# Altium project ascenseur.PrjPCB
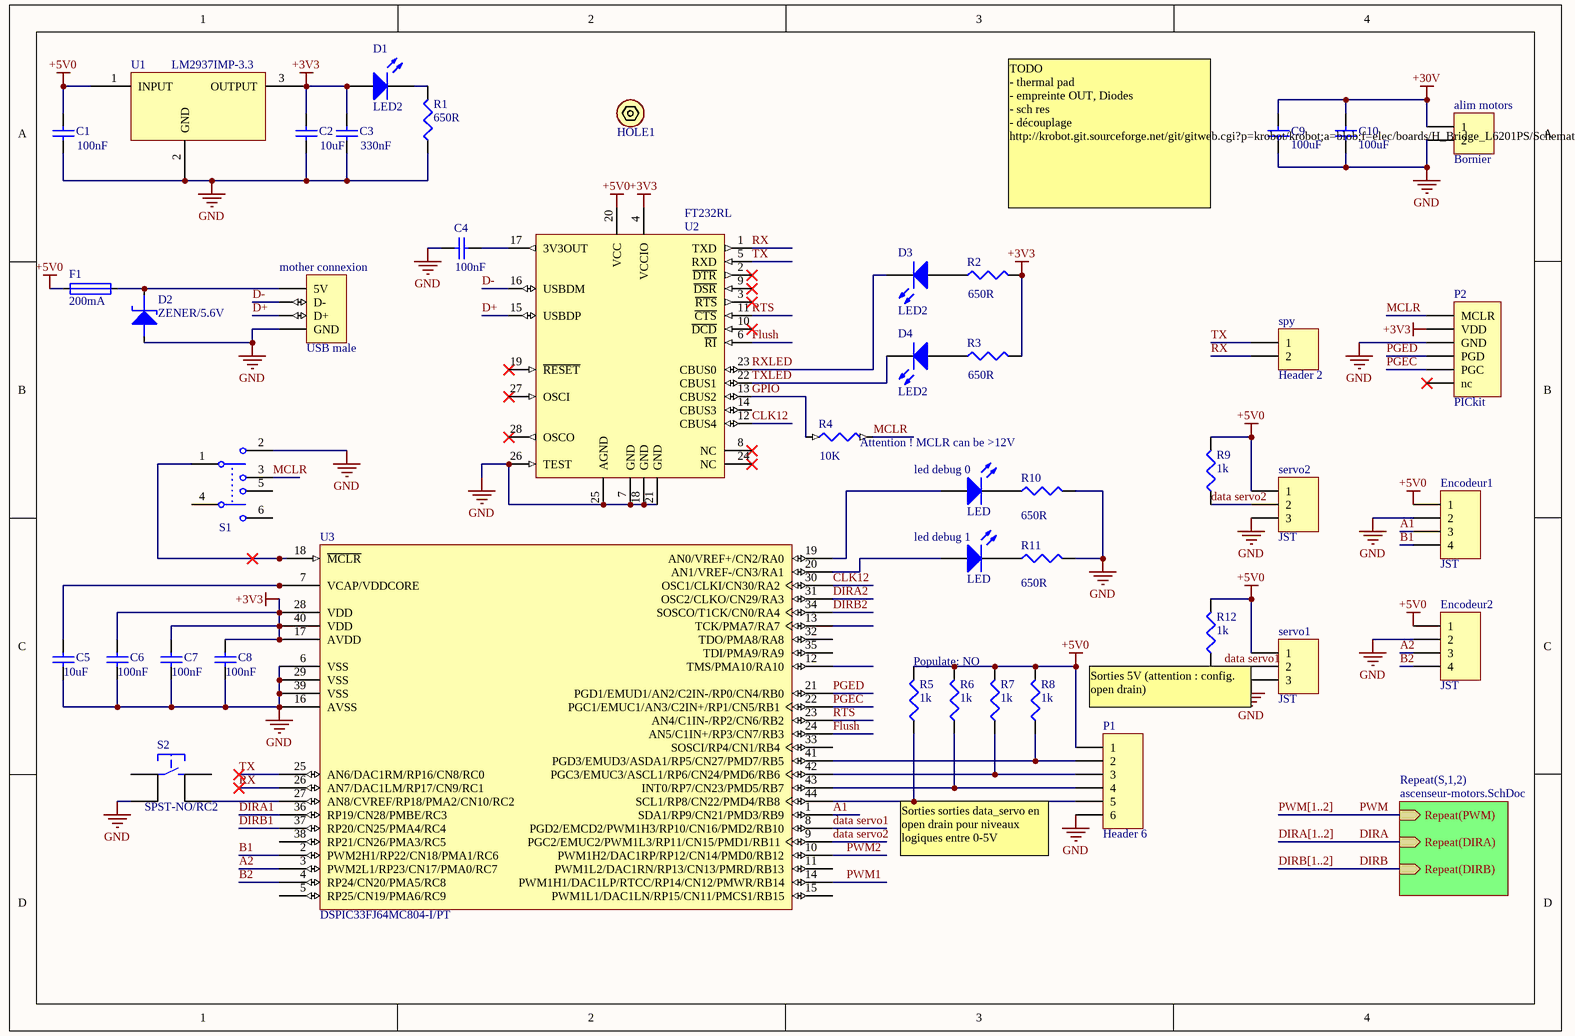
[diagram p0: ascenseur-asserv.SchDoc]
2 sheets, 70 parts. Net scope: hierarchical (ports join the sheet entries above them; power ports are global).
Board file: ascenseur.PcbDoc
Sheets:
  ascenseur-asserv.SchDoc
    S1 = ascenseur-motors.SchDoc
    S2 = ascenseur-motors.SchDoc

## Sheet ascenseur-asserv.SchDoc
size A4

### Parts
(Parts that share a designator on the sheet are numbered #1, #2 ... from top to bottom, then left to right.)
alim_motors  Bornier  [Bornier male coude 2 voies]
C1#1  value 100nF  [C0805C]
C2#1  value 10uF  [C0805C]
C3#1  value 330nF  [C0805C]
C4#1  value 100nF  [C0805C]
C5#1  value 10uF  [C0805C]
C6  value 100nF  [C0805C]
C7  value 100nF  [C0805C]
C8  value 100nF  [C0805C]
C9  value 100uF  [Capacitor axial leaded]  (hidden comment: CAP)
C10  value 100uF  [C0805C]  (hidden comment: CAP)
D1#1  LED2  [LED1206G]
D2  ZENER/5.6V  [DSO-C2/X1.8]
D3  LED2  [LED1206Y]
D4  LED2  [LED1206Y]
Encodeur1  JST  [B4B-PH-K-S]
Encodeur2  JST  [B4B-PH-K-S]
F1  200mA  [Fuse Holder 5x20mm]
HOLE1  Hole  [SCREW]  (value not drawn)
led_debug_0  LED  [LED1206R]
led_debug_1  LED  [LED1206R]
mother_connexion  USB male  [USB SM2.5 Male]
P1  Header 6  [HDR1X6]
P2  PICkit  [HDR1X6H]
R1#1  value 650R  [C0805R]
R2#1  value 650R  [C0805R]
R3  value 650R  [C0805R]
R4  value 10K  [C0805R]
R5  value 1k  Populate: NO  [C0805R]
R6  value 1k  [C0805R]
R7  value 1k  [C0805R]
R8  value 1k  [C0805R]
R9  value 1k  [C0805R]
R10  value 650R  [C0805R]
R11  value 650R  [C0805R]
R12  value 1k  [C0805R]
S1  SW-DPDT/Reset  [MCLSS22]  (value not drawn)
S2  SPST-NO/RC2  [SPST-NO]
servo1  JST  [B3B-PH-K-S]
servo2  JST  [B3B-PH-K-S]
spy  Header 2  [HDR1X2]
U1  LM2937IMP-3.3  [SOT223]
U2  FT232RL  [SSOP-28_M]
U3  DSPIC33FJ64MC804-I/PT  [TQFP-PT44_N]

### Sub-sheets
Repeat(S,1,2) = ascenseur-motors.SchDoc: Repeat(DIRA) (in), Repeat(DIRB) (in), Repeat(PWM) (in)

### Nets
+3V3: C2#1.1 C3#1.1 C6.1 C7.1 C8.1 D1#1.1(A) P2.2(VDD) R2#1.2 R3.2 U1.3(OUTPUT) U2.4(VCCIO) U3.17(AVDD) U3.28(VDD) U3.40(VDD)
+5V0: C1#1.1 Encodeur1.1 Encodeur2.1 F1.1 P1.1 R5.2 R6.2 R7.2 R8.2 R9.2 R12.2 servo1.1 servo2.1 U1.1(INPUT) U2.20(VCC)
+30V: alim_motors.1 C9.2 C10.2
GND: alim_motors.2 C1#1.2 C2#1.2 C3#1.2 C4#1.1 C5#1.2 C6.2 C7.2 C8.2 C9.1 C10.1 D2.A Encodeur1.2 Encodeur2.2 mother_connexion.4(GND) P1.6 P2.3(GND) R1#1.1 R10.2 R11.2 S1.2 S2.2 servo1.3 servo2.3 U1.2(GND) U2.7(GND) U2.18(GND) U2.21(GND) U2.25(AGND) U2.26(TEST) U3.6(VSS) U3.16(AVSS) U3.29(VSS) U3.39(VSS)
A1: Encodeur1.3 U3.1(SDA1/RP9/CN21/PMD3/RB9)
A2: Encodeur2.3 U3.3(PWM2L1/RP23/CN17/PMA0/RC7)
B1: Encodeur1.4 U3.2(PWM2H1/RP22/CN18/PMA1/RC6)
B2: Encodeur2.4 U3.4(RP24/CN20/PMA5/RC8)
CLK12: U2.12(CBUS4) U3.30(OSC1/CLKI/CN30/RA2)
D+: mother_connexion.3(D+) U2.15(USBDP)
D-: mother_connexion.2(D-) U2.16(USBDM)
data servo1: R12.1 servo1.2 U3.8(PGD2/EMCD2/PWM1H3/RP10/CN16/PMD2/RB10)
data servo2: R9.1 servo2.2 U3.9(PGC2/EMUC2/PWM1L3/RP11/CN15/PMD1/RB11)
DIRA: sheet Repeat(S,1,2)/Repeat(DIRA)
DIRA1: U3.36(RP19/CN28/PMBE/RC3)
DIRA2: U3.31(OSC2/CLKO/CN29/RA3)
DIRB: sheet Repeat(S,1,2)/Repeat(DIRB)
DIRB1: U3.37(RP20/CN25/PMA4/RC4)
DIRB2: U3.34(SOSCO/T1CK/CN0/RA4)
Flush: U2.6(~{RI}) U3.24(AN5/C1IN+/RP3/CN7/RB3)
GPIO: R4.1 U2.13(CBUS2)
MCLR: P2.1(MCLR) R4.2 S1.3
PGEC: P2.5(PGC) U3.22(PGC1/EMUC1/AN3/C2IN+/RP1/CN5/RB1)
PGED: P2.4(PGD) U3.21(PGD1/EMUD1/AN2/C2IN-/RP0/CN4/RB0)
PWM: sheet Repeat(S,1,2)/Repeat(PWM)
PWM1: U3.14(PWM1H1/DAC1LP/RTCC/RP14/CN12/PMWR/RB14)
PWM2: U3.10(PWM1H2/DAC1RP/RP12/CN14/PMD0/RB12)
RTS: U2.11(~{CTS}) U3.23(AN4/C1IN-/RP2/CN6/RB2)
RX: spy.2 U2.1(TXD) U3.26(AN7/DAC1LM/RP17/CN9/RC1)
RXLED: D3.2(K) U2.23(CBUS0)
TX: spy.1 U2.5(RXD) U3.25(AN6/DAC1RM/RP16/CN8/RC0)
TXLED: D4.2(K) U2.22(CBUS1)
NetC4#1_2: C4#1.2 U2.17(3V3OUT)
NetC5#1_1: C5#1.1 U3.7(VCAP/VDDCORE)
NetD1#1_2: D1#1.2(K) R1#1.2
NetD2_K: D2.K F1.2 mother_connexion.1(5V)
NetD3_1: D3.1(A) R2#1.1
NetD4_1: D4.1(A) R3.1
Netled_debug_0_1: led_debug_0.1(A) U3.19(AN0/VREF+/CN2/RA0)
Netled_debug_0_2: led_debug_0.2(K) R10.1
Netled_debug_1_1: led_debug_1.1(A) U3.20(AN1/VREF-/CN3/RA1)
Netled_debug_1_2: led_debug_1.2(K) R11.1
NetP1_2: P1.2 R8.1 U3.41(PGD3/EMUD3/ASDA1/RP5/CN27/PMD7/RB5)
NetP1_3: P1.3 R7.1 U3.42(PGC3/EMUC3/ASCL1/RP6/CN24/PMD6/RB6)
NetP1_4: P1.4 R6.1 U3.43(INT0/RP7/CN23/PMD5/RB7)
NetP1_5: P1.5 R5.1 U3.44(SCL1/RP8/CN22/PMD4/RB8)
NetS1_1: S1.1 U3.18(~{MCLR})
NetS2_3: S2.3 U3.27(AN8/CVREF/RP18/PMA2/CN10/RC2)

Not connected (* = marked no-connect by the designer): HOLE1 1(Hole); P2 6(nc)*; S1 4 5 6; S2 1 4; U2 2(~{DTR})* 3(~{RTS})* 8(NC)* 9(~{DSR})* 10(~{DCD})* 14(CBUS3) 19(~{RESET})* 24(NC)* 27(OSCI)* 28(OSCO)*; U3 5(RP25/CN19/PMA6/RC9) 11(PWM1L2/DAC1RN/RP13/CN13/PMRD/RB13) 12(TMS/PMA10/RA10) 13(TCK/PMA7/RA7) 15(PWM1L1/DAC1LN/RP15/CN11/PMCS1/RB15) 32(TDO/PMA8/RA8) 33(SOSCI/RP4/CN1/RB4) 35(TDI/PMA9/RA9) 38(RP21/CN26/PMA3/RC5)

### Buses and harness runs
bus DIRA[1..2]
bus DIRB[1..2]
bus PWM[1..2]

### Notes on the sheet
- TODO
  - thermal pad
  - empreinte OUT, Diodes
  - sch res
  - découplage
  http://krobot.git.sourceforge.net/git/gitweb.cgi?p=krobot/krobot;a=blob;f=elec/boards/H_Bridge_L6201PS/Schematic/PDF/H-Bridge+L6201PS-1.0.pdf;h=d59c3899e5ad71452fc4e603ce3d9e1f74365359;hb=e88cc49
- (near R4) Attention ! MCLR can be >12V
- (near R12) Sorties 5V (attention : config. open drain)
- Sorties sorties data_servo en open drain pour niveaux logiques entre 0-5V

### Library data of the parts
alim_motors spy = Header 2: Header, 2-Pin; LatestRevisionDate: 17-Jul-2002; LatestRevisionNote: Re-released for DXP Platform.; Publisher: Altium Limited
C1#1 C2#1 C3#1 C4#1 C5#1 C6-C8 = Cap Semi: Capacitor (Semiconductor SIM Model); Published: 8-Jun-2000; LatestRevisionDate: 29-May-2009; LatestRevisionNote: IPC-7351 Footprint Added.; PackageReference: C1206; Publisher: Altium Limited; PackageDescription: Chip Capacitor
C9 C10 = CAP: Capacitor; Published: 8-Jun-2000; LatestRevisionDate: 29-May-2009; LatestRevisionNote: IPC-7351 Footprint Added.; PackageReference: C1206; Publisher: Altium Limited; PackageDescription: Chip Capacitor
D1#1 D3 D4 led_debug_0 led_debug_1 = LED2: Typical RED, GREEN, YELLOW, AMBER GaAs LED; Published: 8-Jun-2000; LatestRevisionDate: 17-Jul-2002; LatestRevisionNote: Re-released for DXP Platform.; PackageVersion: Feb-2002; PackageReference: 3.2X1.6X1.1; Publisher: Altium Limited; PackageDescription: SM LED; 2 Flat Leads
D2 = ZENER
Encodeur1 Encodeur2 = Header 4: Header, 4-Pin; LatestRevisionDate: 17-Jul-2002; LatestRevisionNote: Re-released for DXP Platform.; Publisher: Altium Limited
F1 = FUSE1
HOLE1 = Hole: Mounting Hole for screws
mother_connexion = USB Con: USB Connector; LatestRevisionDate: 17-Jul-2002; LatestRevisionNote: Re-released for DXP Platform.; Publisher: Altium Limited
P1 = Header 6: Header, 6-Pin; LatestRevisionDate: 17-Jul-2002; LatestRevisionNote: Re-released for DXP Platform.; Publisher: Altium Limited
P2 = Header ICSP: Header, 6-Pin, Right Angle; LatestRevisionDate: 17-Jul-2002; LatestRevisionNote: Re-released for DXP Platform.; Publisher: Altium Limited
R1#1 R2#1 R3-R12 = Res3: Resistor; Published: 8-Jun-2000; LatestRevisionDate: 29-May-2009; LatestRevisionNote: IPC-7351 Footprint Added.; PackageReference: J1-0603; Publisher: Altium Limited; PackageDescription: Chip Resistor
S1 = SW-DPDT: Double-Pole, Double-Throw Switch, ref MCLSS22; Published: 24-Mar-1999; LatestRevisionDate: 17-Jul-2002; LatestRevisionNote: Re-released for DXP Platform.; PackageReference: DPDT-6; Publisher: Altium Limited; PackageDescription: Switch; 6 Leads
S2 = SPST-NO: Tactile Switch 7.3mm, SMD
servo1 servo2 = Header 3: Header, 3-Pin; LatestRevisionDate: 17-Jul-2002; LatestRevisionNote: Re-released for DXP Platform.; Publisher: Altium Limited
U1 = LM2937IMP-3.3: 500 mA Low Dropout Regulator
U2 = FT232RL: USB UART Asynchronous Serial Data Transfer Chip, SSOP-28, Tube; Published: 19-Aug-2010; DatasheetVersion: ver 2.07, Jul-2010; PackageVersion: 2010; PackageReference: SSOP-28; Publisher: Altium Limited; PackageDescription: 28-Pin Small Outline Package 0.65 mm Pitch; ComponentLink1Description: Manufacturer Link; ComponentLink1URL: http://www.ftdichip.com/Products/ICs/FT232R.htm; ComponentLink2Description: Datasheet; ComponentLink2URL: http://www.ftdichip.com/Support/Documents/DataSheets/ICs/DS_FT232R.pdf
U3 = DSPIC33FJ64MC804-I/PT: High-Performance 16-bit Digital Signal Controller, 64 KB Flash, 16 KB RAM, 44-Pin TQFP, Industrial Temperature; Published: 2-Dec-2009; DatasheetVersion: revD, Nov-2009; PackageVersion: revBB, Aug-2009; PackageReference: TQFP-PT44; Publisher: Altium Limited; PackageDescription: 44-Lead Plastic Thin Quad Flatpack (PT) - 10x10x1mm Body, 2.00mm [TQFP]; Supplier 1: Digi-Key; Supplier Part Number 1: DSPIC33FJ64MC804-I/PT-ND; Supplier 2: Farnell; Supplier Part Number 2: 1576844; Code_JEDEC: MS-026; ComponentLink1Description: Datasheet; ComponentLink1URL: http://ww1.microchip.com/downloads/en/DeviceDoc/70291D.pdf; ComponentLink2Description: Packaging Specification; ComponentLink2URL: http://www.microchip.com/stellent/groups/techpub_sg/documents/packagingspec/en012702.pdf; ComponentLink3Description: Microchip.com Home; ComponentLink3URL: http://www.microchip.com/

## Sheet ascenseur-motors.SchDoc
size A4
Used 2 times, as channels S1, S2. Parts and nets are listed once, with the designators drawn on the sheet.
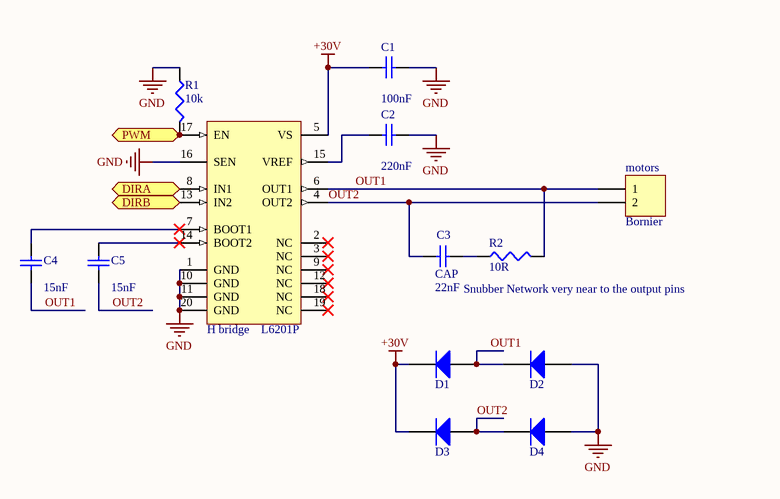
[diagram p1: ascenseur-motors.SchDoc]

### Parts
C1  value 100nF  [C0805C]  (hidden comment: CAP)
C2  value 220nF  [C0805C]  (hidden comment: CAP)
C3  CAP  value 22nF  [C0805C]
C4  value 15nF  [C0805C]  (hidden comment: CAP)
C5  value 15nF  [C0805C]  (hidden comment: CAP)
D1  Diode  [DSO-C2/X3.3]  (value not drawn)
D2  Diode  [DSO-C2/X3.3]  (value not drawn)
D3  Diode  [DSO-C2/X3.3]  (value not drawn)
D4  Diode  [DSO-C2/X3.3]  (value not drawn)
H_bridge  L6201P  [PowerSO20_M]
motors  Bornier  [Bornier male coude 2 voies]
R1  value 10k  [C0805R]  (hidden comment: RES)
R2  value 10R  [C0805R]  (hidden comment: RES)

### Ports
DIRA (in), DIRB (in), PWM (in)

### Nets
+30V: C1.2 D1.K D3.K H_bridge.5(VS)
GND: C1.1 C2.1 D2.A D4.A H_bridge.1(GND) H_bridge.10(GND) H_bridge.11(GND) H_bridge.16(SEN) H_bridge.20(GND) R1.1
DIRA: H_bridge.8(IN1) ; port DIRA
DIRB: H_bridge.13(IN2) ; port DIRB
OUT1: C4.2 D1.A D2.K H_bridge.6(OUT1) motors.1 R2.2
OUT2: C3.2 C5.2 D3.A D4.K H_bridge.4(OUT2) motors.2
PWM: H_bridge.17(EN) R1.2 ; port PWM
NetC2_2: C2.2 H_bridge.15(VREF)
NetC3_1: C3.1 R2.1
NetC4_1: C4.1 H_bridge.7(BOOT1)
NetC5_1: C5.1 H_bridge.14(BOOT2)

Not connected (* = marked no-connect by the designer): H_bridge 2(NC)* 3(NC)* 9(NC)* 12(NC)* 18(NC)* 19(NC)*

### Channels
S1: designators C1=C1#2 C2=C2#2 C3=C3#2 C4=C4#2 C5=C5#2 D1=D1#2 D2=D2_S1 D3=D3_S1 D4=D4_S1 H bridge=H_bridge_S1 motors=mot1 R1=R1#2 R2=R2#2; ports DIRA=DIRA1 DIRB=DIRB1 PWM=PWM1
S2: designators C1=C1#3 C2=C2#3 C3=C3#3 C4=C4#3 C5=C5#3 D1=D1#3 D2=D2_S2 D3=D3_S2 D4=D4_S2 H bridge=H_bridge_S2 motors=mot2 R1=R1#3 R2=R2#3; ports DIRA=DIRA2 DIRB=DIRB2 PWM=PWM2

### Notes on the sheet
- Snubber Network very near to the output pins

### Library data of the parts
C1-C5 = CAP: Capacitor; Published: 8-Jun-2000; LatestRevisionDate: 29-May-2009; LatestRevisionNote: IPC-7351 Footprint Added.; PackageReference: C1206; Publisher: Altium Limited; PackageDescription: Chip Capacitor
D1-D4 = Diode: Default Diode; Published: 8-Jun-2000; LatestRevisionDate: 17-Jul-2002; LatestRevisionNote: Re-released for DXP Platform.; PackageVersion: Sep-1996; PackageReference: SMC; Publisher: Altium Limited; PackageDescription: DO-214-AB/SMC; 2 C-Bend Leads; Body 7.9 x 5.9 mm, inc. leads (LxW); Code_JEDEC: DO-214-AB
H_bridge = L6201P: DMOS Full Bridge Driver; Published: 8-Jun-2000; LatestRevisionDate: 13-Apr-2006; LatestRevisionNote: IPC-7351 Footprint Added.; DatasheetVersion: Sep-1996; PackageVersion: May-1998; PackageReference: PowerSO20; Publisher: Altium Limited; PackageDescription: 20-Pin Small Outline Package 1.27 mm Pitch; Code_JEDEC: MO-166; ComponentLink1Description: Manufacturer Link; ComponentLink1URL: http://www.st.com/
motors = Header 2: Header, 2-Pin; LatestRevisionDate: 17-Jul-2002; LatestRevisionNote: Re-released for DXP Platform.; Publisher: Altium Limited
R1 R2 = RES: Resistor; Published: 8-Jun-2000; LatestRevisionDate: 29-May-2009; LatestRevisionNote: IPC-7351 Footprint Added.; PackageReference: J1-0603; Publisher: Altium Limited; PackageDescription: Chip Resistor

## Nets that join several sheets
+30V: ascenseur-asserv (alim_motors.1 C9.2 C10.2), S1 (C1#2.2 D1#2.K D3_S1.K H_bridge_S1.5), S2 (C1#3.2 D1#3.K D3_S2.K H_bridge_S2.5)
GND: ascenseur-asserv (34 pins), S1 (10 pins), S2 (10 pins)
DIRA1: ascenseur-asserv (U3.36), S1 (H_bridge_S1.8)
DIRA2: ascenseur-asserv (U3.31), S2 (H_bridge_S2.8)
DIRB1: ascenseur-asserv (U3.37), S1 (H_bridge_S1.13)
DIRB2: ascenseur-asserv (U3.34), S2 (H_bridge_S2.13)
PWM1: ascenseur-asserv (U3.14), S1 (H_bridge_S1.17 R1#2.2)
PWM2: ascenseur-asserv (U3.10), S2 (H_bridge_S2.17 R1#3.2)